# EAGLE design card_shield (EAGLE 9.2.0)
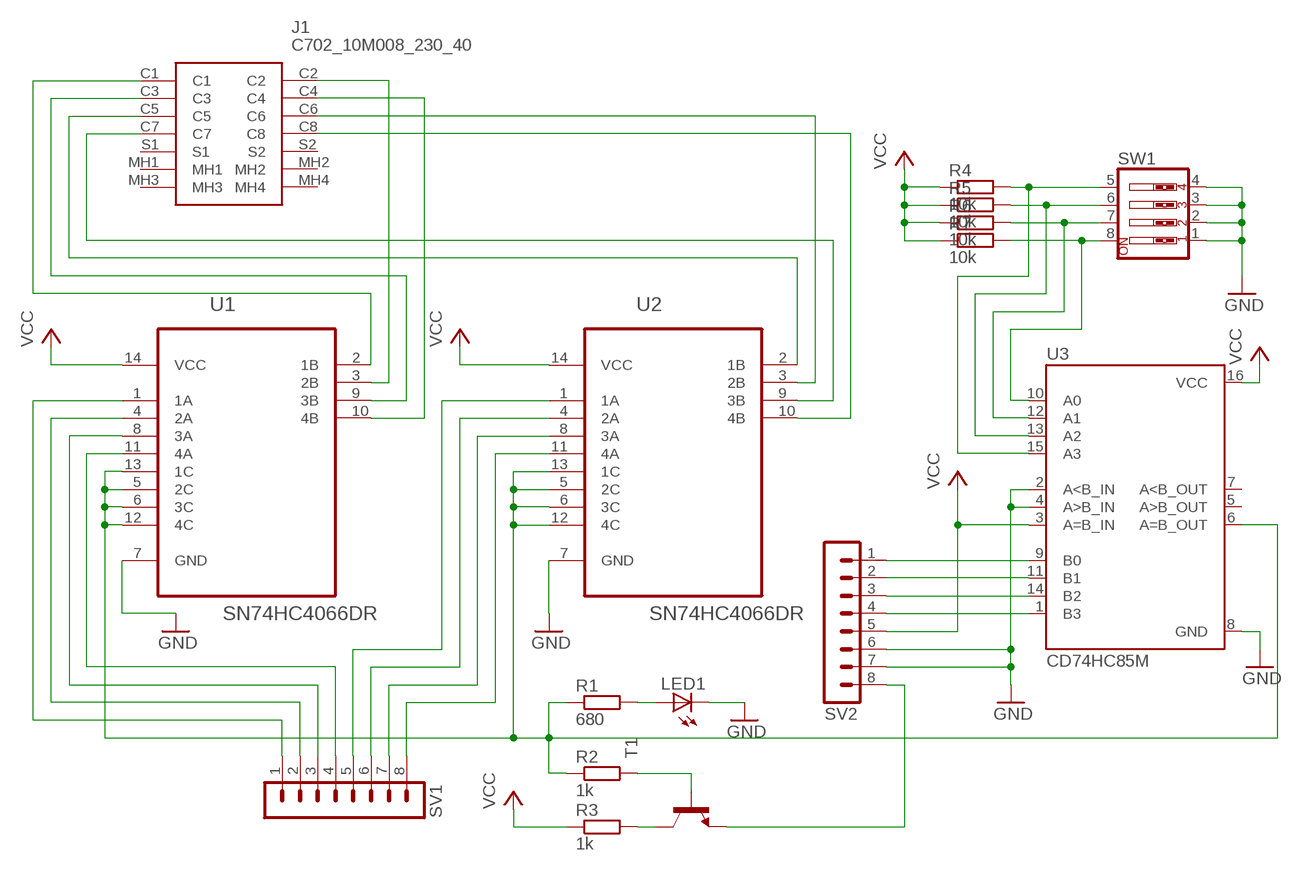
[diagram p0: schematic, sheet 1]

## Parts
J1  C702_10M008_230_40  [C70210M00823040]
LED1  LEDSML1206  [SML1206]
R1  680  R-EU_R0805  [R0805]
R2  1k  R-EU_R0805  [R0805]
R3  1k  R-EU_R0805  [R0805]
R4  10k  R-EU_R0805  [R0805]
R5  10k  R-EU_R0805  [R0805]
R6  10k  R-EU_R0805  [R0805]
R7  10k  R-EU_R0805  [R0805]
SV1  MA08-1  [MA08-1]
SV2  MA08-1  [MA08-1]
SW1  SW_DIP-4  [EDG-04]
T1  BC817-16-NPN-SOT23-BEC  [SOT23-BEC]
U1  SN74HC4066DR  [SOIC127P600X175-14N]
U2  SN74HC4066DR  [SOIC127P600X175-14N]
U3  CD74HC85M  [SOIC12P600X175-16N]

## Nets
GND: LED1.C SV2.6 SV2.7 SW1.1 SW1.2 SW1.3 SW1.4 U1.7(GND) U2.7(GND) U3.2(A<B_IN) U3.4(A>B_IN) U3.8(GND)
N$1: J1.C1 U1.2(1B)
N$2: J1.C3 U1.9(3B)
N$3: J1.C2 U1.3(2B)
N$4: J1.C4 U1.10(4B)
N$5: J1.C5 U2.2(1B)
N$6: J1.C6 U2.3(2B)
N$7: J1.C7 U2.9(3B)
N$8: J1.C8 U2.10(4B)
N$9: SV1.1 U1.1(1A)
N$10: SV1.2 U1.4(2A)
N$11: SV1.3 U1.8(3A)
N$12: SV1.4 U1.11(4A)
N$13: SV1.5 U2.1(1A)
N$14: SV1.6 U2.4(2A)
N$15: SV1.7 U2.8(3A)
N$16: SV1.8 U2.11(4A)
N$17: R1.1 R2.1 U1.5(2C) U1.6(3C) U1.12(4C) U1.13(1C) U2.5(2C) U2.6(3C) U2.12(4C) U2.13(1C) U3.6(A=B_OUT)
N$18: LED1.A R1.2
N$19: SV2.1 U3.9(B0)
N$20: R2.2 T1.B
N$21: SV2.2 U3.11(B1)
N$23: SV2.3 U3.14(B2)
N$24: SV2.4 U3.1(B3)
N$25: R7.2 SW1.8 U3.10(A0)
N$26: R6.2 SW1.7 U3.12(A1)
N$27: R5.2 SW1.6 U3.13(A2)
N$28: R4.2 SW1.5 U3.15(A3)
N$29: R3.2 T1.C
N$30: SV2.8 T1.E
VCC: R3.1 R4.1 R5.1 R6.1 R7.1 SV2.5 U1.14(VCC) U2.14(VCC) U3.3(A=B_IN) U3.16(VCC)
Unconnected: J1.MH1 J1.MH2 J1.MH3 J1.MH4 J1.S1 J1.S2 U3.5(A>B_OUT) U3.7(A<B_OUT)

## Library data of the parts
J1 = SamacSys_Parts:C702_10M008_230_40: AMPHENOL SINE/TUCHEL - C702 10M008 230 40 - SMART CARD, C702, WIPING XXS Source: Datasheet <https://componentsearchengine.com/Datasheets/1/C702 10M008 230 40.pdf>; DESCRIPTION: AMPHENOL SINE/TUCHEL - C702 10M008 230 40 - SMART CARD, C702, WIPING XXS; HEIGHT: 6mm; MANUFACTURER_NAME: Amphenol; MANUFACTURER_PART_NUMBER: C702 10M008 230 40; MOUSER_PART_NUMBER: 523-C70210M00823040
LED1 = led:LED: LED OSRAM: - CHIPLED LG R971, LG N971, LY N971, LG Q971, LY Q971, LO R971, LY R971 LH N974, LH R974 LS Q976, LO Q976, LY Q976 LO Q996 - Hyper CHIPLED LW Q18S LB Q993, LB Q99A, LB R99A - SideLED LS A670, LO A670, LY A670, LG A670, LP A670 LB A673, LV A673, LT A673, LW A673 LH A674 LY A675 LS A676, LA A676, LO A676, LY A676, LW A676 LS A679, LY A679, LG A679 - Hyper Micro SIDELED® LS Y876, LA Y876, LO Y876, LY Y876 LT Y87S - SmartLED LW L88C, LW L88S LB L89C, LB L89S, LG L890 LS L89K, LO L89K, LY L89K LS L896, LA L896, LO L896, LY L896 - TOPLED LS T670, LO T670, LY T670, LG T670, LP T670 LSG T670, LSP T670, LSY T670, LOP T670, LYG T670 LG T671, LOG T671, LSG T671 LB T673, LV T673, LT T673, LW T673 LH T674 LS T676, LA T676, LO T676, LY T676, LB T676, LH T676, LSB T676, LW T676 LB T67C, LV T67C, LT T67C, LS T67K, LO T67K, LY T67K, LW E67C LS E67B, LA E67B, LO E67B, LY E67B, LB E67C, LV E67C, LT E67C LW T67C LS T679, LY T679, LG T679 LS T770, LO T770, LY T770, LG T770, LP T770 LB T773, LV T773, LT T773, LW T773 LH T774 LS E675, LA E675, LY E675, LS T675 LS T776, LA T776, LO T776, LY T776, LB T776 LHGB T686 LT T68C, LB T68C - Hyper Mini TOPLED® LB M676 - Mini TOPLED Santana® LG M470 LS M47K, LO M47K, LY M47K Source: http://www.osram.convergy.de LUXEON: - LUMILED® LXK2-PW12-R00, LXK2-PW12-S00, LXK2-PW14-U00, LXK2-PW14-V00 LXK2-PM12-R00, LXK2-PM12-S00, LXK2-PM14-U00 LXK2-PE12-Q00, LXK2-PE12-R00, LXK2-PE12-S00, LXK2-PE14-T00, LXK2-PE14-U00 LXK2-PB12-K00, LXK2-PB12-L00, LXK2-PB12-M00, LXK2-PB14-N00, LXK2-PB14-P00, LXK2-PB14-Q00 LXK2-PR12-L00, LXK2-PR12-M00, LXK2-PR14-Q00, LXK2-PR14-R00 LXK2-PD12-Q00, LXK2-PD12-R00, LXK2-PD12-S00 LXK2-PH12-R00, LXK2-PH12-S00 LXK2-PL12-P00, LXK2-PL12-Q00, LXK2-PL12-R00 Source: www.luxeon.com KINGBRIGHT: KA-3528ASYC Source: www.kingbright.com
R1-R7 = rcl:R-EU_: RESISTOR, European symbol; SPICEPREFIX: R
SV1 SV2 = con-lstb:MA08-1: PIN HEADER; OC_FARNELL: unknown; OC_NEWARK: unknown
SW1 = special:SW_DIP-4: DIP SWITCH
T1 = transistor:*-NPN-: NPN Transistror BF959 corrected 2008.03.06
U1 U2 = SN74HC4066DR:SN74HC4066DR: QUADRUPLE BILATERAL ANALOG SWITCH; AVAILABILITY: Unavailable; DESCRIPTION: Logic - Signal Switches Quadruple Bilateral Analog Switches; MF: Texas Instruments; MP: SN74HC4066DR; PACKAGE: SOIC-14 Texas Instruments; PRICE: None
U3 = CD74HC85M:CD74HC85M: IC: digital; 4bit, comparator; SMD; SO16; Series: HC; AVAILABILITY: Unavailable; DESCRIPTION: IC: digital; 4bit, comparator; SMD; SO16; Series: HC; MF: Texas Instruments; MP: CD74HC85M; PACKAGE: SOIC-16 Texas Instruments; PRICE: None

## Board
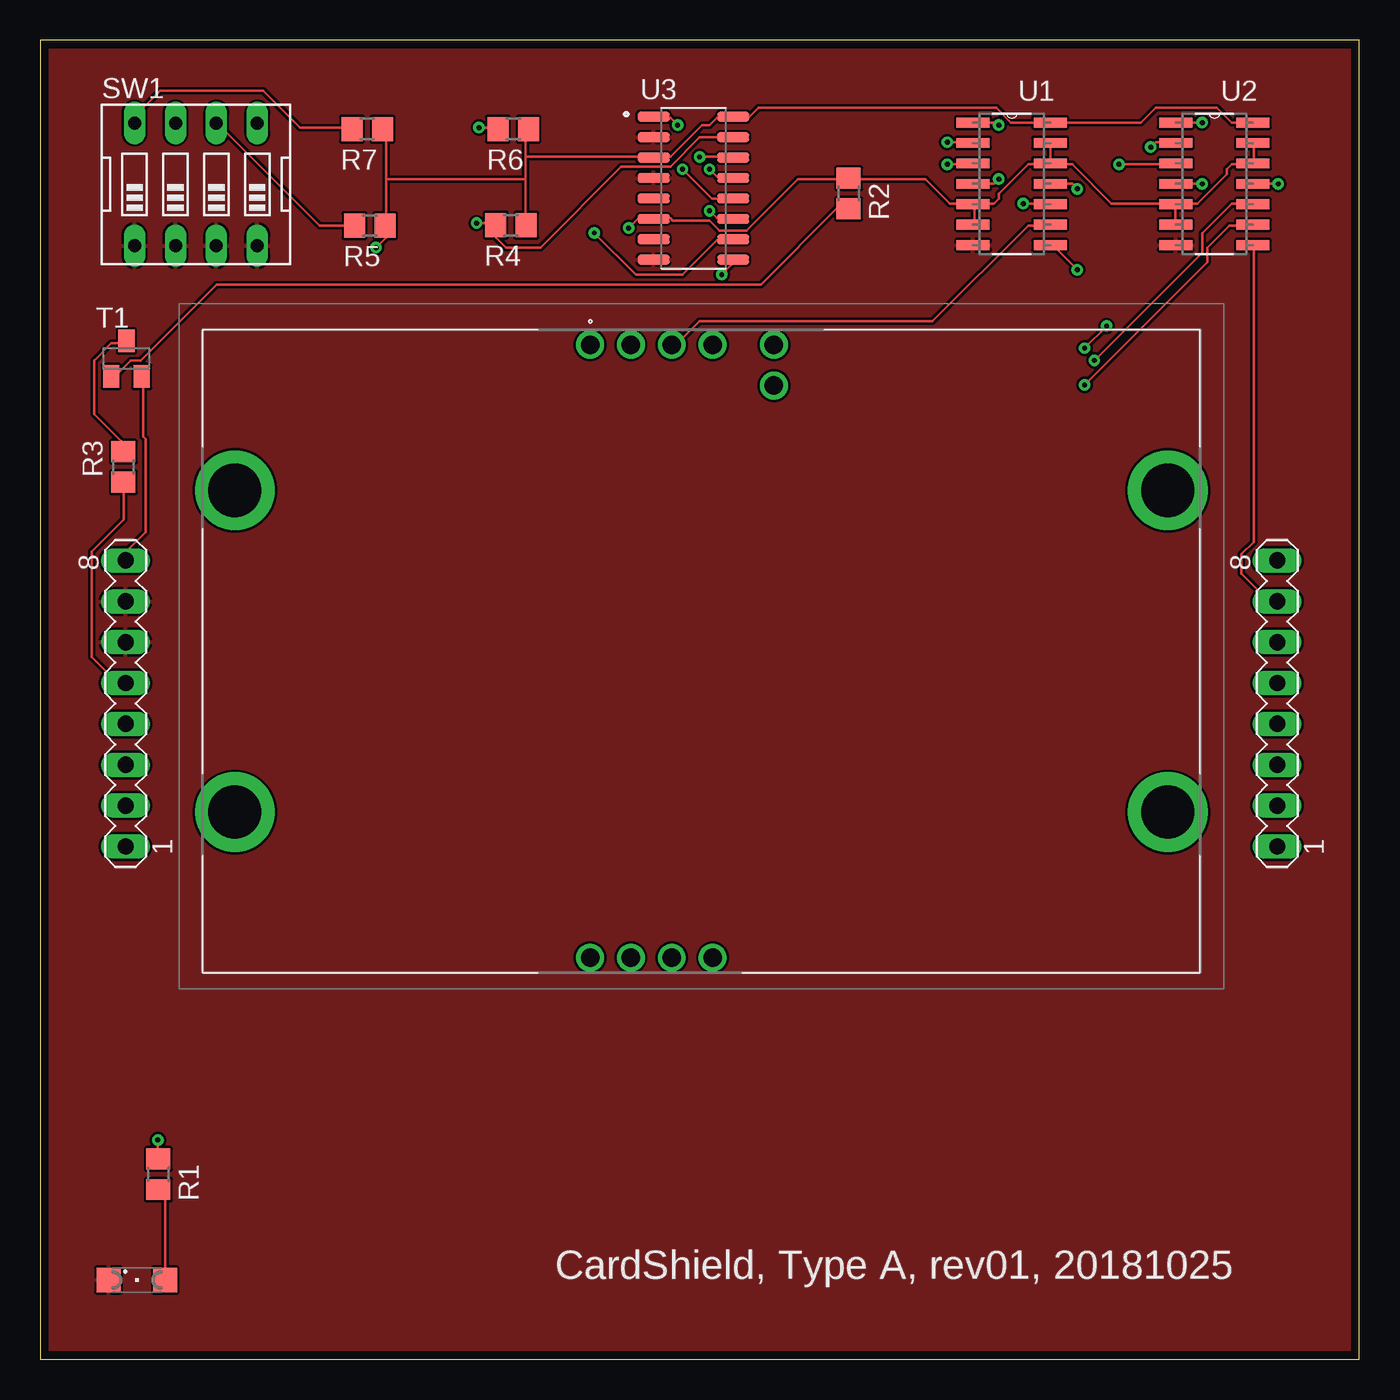
[diagram p1: board, top side]
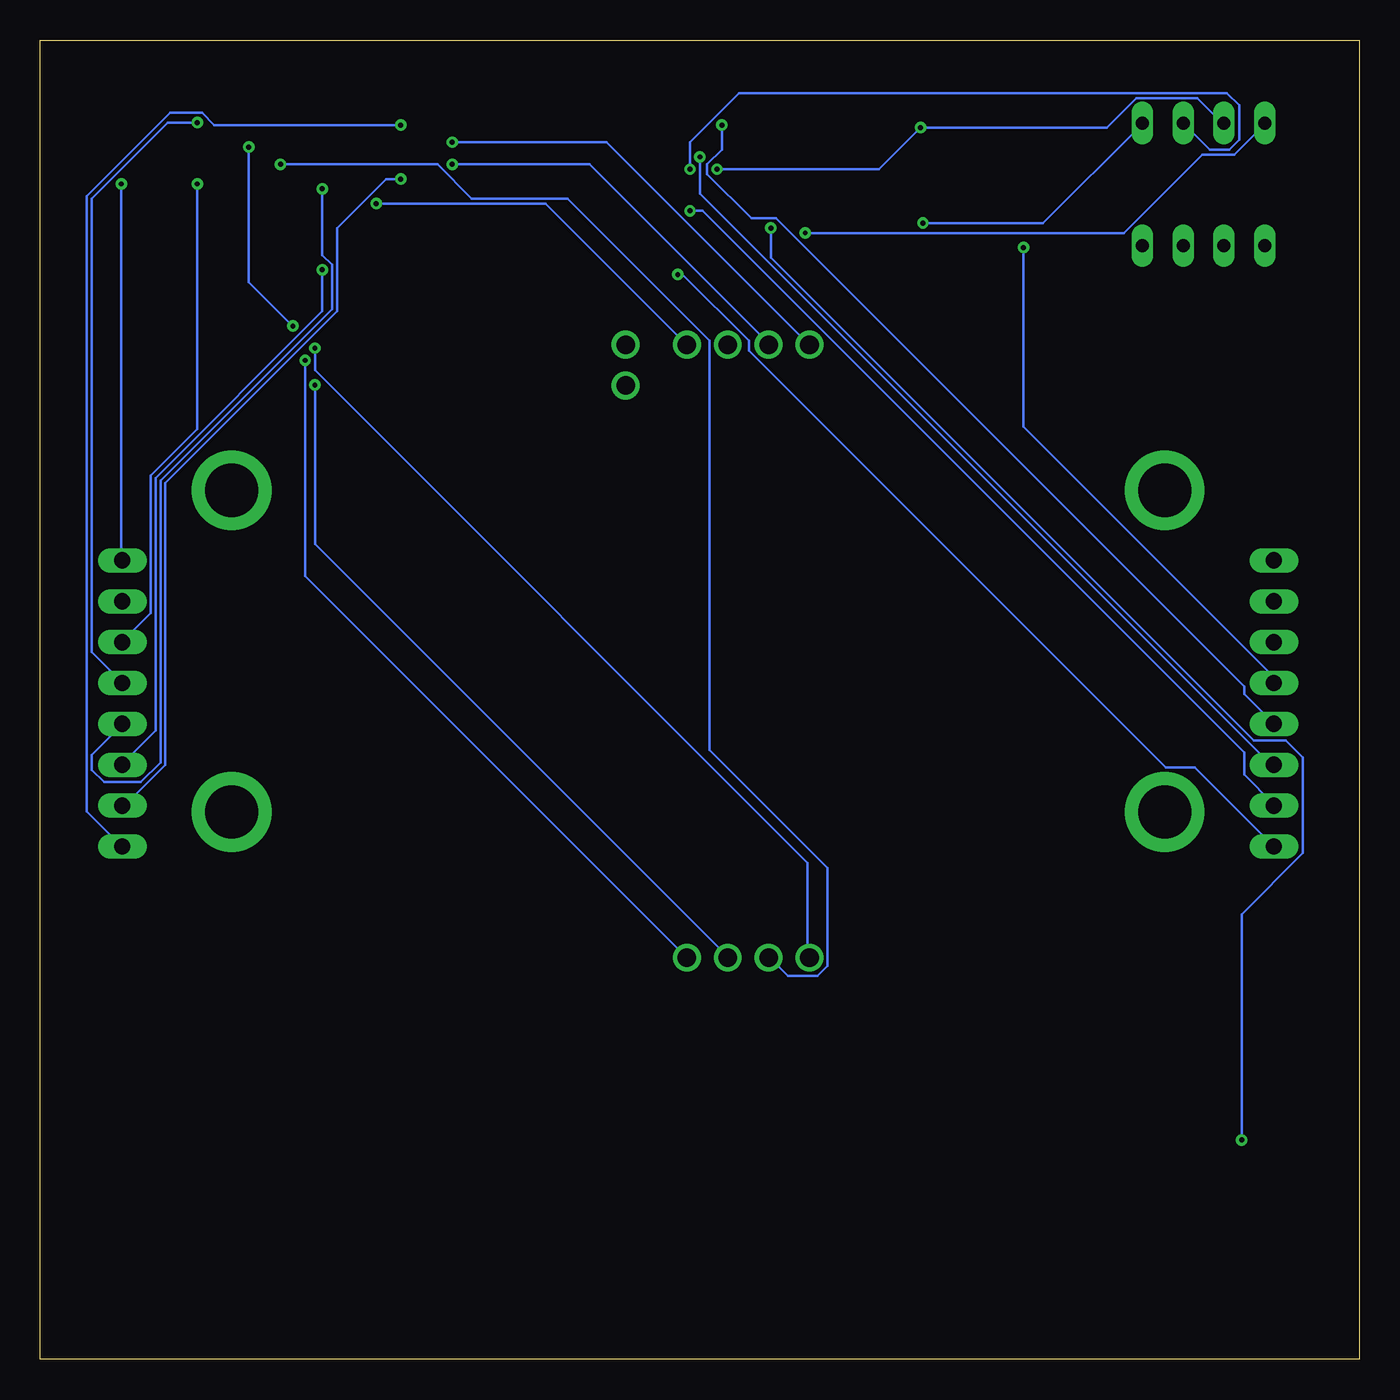
[diagram p2: board, bottom side, seen from below]

Size 82 x 82 mm. Coordinates in mm from the lower left corner, seen from the top.
Outline: 0,0 82,0 82,82 0,82 0,0
Copper layers (1*16): Top 0.035mm / dielectric 1.5mm / Bottom 0.035mm
Design rules "NYAKARUHAZ_StandardNYAK": minimum track width 6mil, minimum drill 12mil, track to track 6mil, track to pad 6mil, pad to pad 6mil, via to via 6mil, smd to smd 6mil, copper to edge 20mil, drill to drill 8mil, minimum pad ring 10mil, minimum via ring 8mil, stop-mask expansion 4mil, vias tented up to drill 0mil, thermal gap 6mil

### Footprints (pad centres in the part's own frame; a part is rotated, then mirrored left to right if it is on the bottom)
C70210M00823040 = drill 1.15 pad 1.725: C1 -6.92,19.05; C2 -4.38,19.05; C3 -1.84,19.05; C4 0.7,19.05; C5 -6.92,-19.05; C6 -4.38,-19.05; C7 -1.84,-19.05; C8 0.7,-19.05; S1 4.51,19.05; S2 4.51,16.51 | drill 3.3 pad 4.95: MH1 -29,10; MH2 -29,-10; MH3 29,10; MH4 29,-10
SML1206 = smd 1.5 x 1.5: A 1.75,0; C -1.75,0
R0805 = smd 1.3 x 1.5: 1 -0.95,0; 2 0.95,0
MA08-1 = drill 1.016 long: 1 -8.89,0; 2 -6.35,0; 3 -3.81,0; 4 -1.27,0; 5 1.27,0; 6 3.81,0; 7 6.35,0; 8 8.89,0
EDG-04 = drill 0.813 long: 1 -3.81,-3.81; 2 -1.27,-3.81; 3 1.27,-3.81; 4 3.81,-3.81; 5 3.81,3.81; 6 1.27,3.81; 7 -1.27,3.81; 8 -3.81,3.81
SOT23-BEC = smd 1 x 1.4: B -0.95,-1.1; C 0,1.1; E 0.95,-1.1
SOIC127P600X175-14N = smd 2.057 x 0.61: 1 -4.801,7.62; 2 -4.801,6.35; 3 -4.801,5.08; 4 -4.801,3.81; 5 -4.801,2.54; 6 -4.801,1.27; 7 -4.801,0; 8 0,0; 9 0,1.27; 10 0,2.54; 11 0,3.81; 12 0,5.08; 13 0,6.35; 14 0,7.62
SOIC12P600X175-16N = smd 1.97 x 0.6: 1 -2.475,4.445; 2 -2.475,3.175; 3 -2.475,1.905; 4 -2.475,0.635; 5 -2.475,-0.635; 6 -2.475,-1.905; 7 -2.475,-3.175; 8 -2.475,-4.445; 9 2.475,-4.445; 10 2.475,-3.175; 11 2.475,-1.905; 12 2.475,-0.635; 13 2.475,0.635; 14 2.475,1.905; 15 2.475,3.175; 16 2.475,4.445

### Placement (x,y rotation side)
J1  41.1,44.02 0 top
LED1  6.01,4.93 0 top
R1  7.34,11.5 270 top
R2  50.25,72.47 270 top
R3  5.17,55.47 90 top
R4  29.26,70.5 180 top
R5  20.49,70.47 180 top
R6  29.41,76.47 180 top
R7  20.33,76.47 180 top
SV1  76.9,40.77 90 top
SV2  5.31,40.77 90 top
SW1  9.68,73.04 0 top
T1  5.36,62.2 0 top
U1  62.79,69.26 0 top
U2  75.39,69.26 0 top
U3  40.61,72.8 0 top

### Tracks (layer width: path | path; a pad name or v marks a point on that pad's centre or on a via)
GND
  pour Top: -1,83 85,83 87,81 87,-18 -2,-18 -2,82
N$1  (via drill 0.3)
  Top 0.152: v56.39,75.66 57.91,75.66 U1.2
  Bottom 0.152: v56.39,75.66 46.79,75.66 34.29,63.16 J1.C1
N$2
  Top 0.152: U1.9 62.79,70.48 61.42,70.48 55.47,64.53 41,64.53 39.62,63.16 39.32,63.16 J1.C3
N$3  (via drill 0.3)
  Top 0.152: v56.39,74.29 57.91,74.29 U1.3
  Bottom 0.152: v56.39,74.29 47.85,74.29 36.73,63.16 J1.C2
N$4  (via drill 0.3)
  Top 0.152: v61.11,71.85 62.79,71.85 U1.10
  Bottom 0.152: v61.11,71.85 50.6,71.85 41.91,63.16 J1.C4
N$5  (via drill 0.3)
  Top 0.152: v69.04,75.35 69.34,75.66 70.56,75.66 U2.2 | v64.92,62.86 v66.29,64.23
  Bottom 0.152: v69.04,75.35 69.04,66.97 v66.29,64.23 | v64.92,62.86 64.92,61.49 34.29,30.85 34.29,24.97 J1.C5
N$6  (via drill 0.3)
  Top 0.152: v67.06,74.29 70.56,74.29 U2.3
  Bottom 0.152: v67.06,74.29 57.3,74.29 55.17,72.15 49.23,72.15 40.39,63.31 40.39,37.86 33.07,30.55 33.07,24.45 33.68,23.84 35.51,23.84 36.58,24.91 J1.C6
N$7  (via drill 0.3)
  Top 0.152: v64.92,60.57 72.54,68.19 72.54,69.11 73.91,70.48 75.29,70.48 U2.9
  Bottom 0.152: v64.92,60.57 64.92,50.67 39.32,25.06 J1.C7
N$8  (via drill 0.3)
  Top 0.152: v65.53,62.1 72.24,68.8 72.24,70.02 74.07,71.85 75.29,71.85 U2.10
  Bottom 0.152: v65.53,62.1 65.53,48.68 41.91,25.06 J1.C8
N$9  (via drill 0.3)
  Top 0.152: v59.59,76.73 59.44,76.88 58.06,76.88 U1.1
  Bottom 0.152: v59.59,76.73 71.17,76.73 71.93,77.49 73.91,77.49 79.1,72.31 79.1,34.05 76.96,31.92 SV1.1
N$10  (via drill 0.3)
  Top 0.152: v59.59,73.37 59.28,73.07 58.06,73.07 U1.4
  Bottom 0.152: v59.59,73.37 60.5,73.37 63.55,70.33 63.55,65.14 74.22,54.48 74.22,36.95 76.81,34.36 SV1.2
N$11  (via drill 0.3)
  Top 0.152: v64.47,67.73 62.94,69.26 U1.8
  Bottom 0.152: v64.47,67.73 64.47,65.14 74.83,54.78 74.83,39.08 76.81,37.1 SV1.3
N$12  (via drill 0.3)
  Top 0.152: v64.47,72.76 64.16,73.07 62.94,73.07 U1.11
  Bottom 0.152: v64.47,72.76 64.47,68.65 63.86,68.04 63.86,65.3 74.52,54.63 74.52,37.1 75.74,35.88 78.03,35.88 78.79,36.65 78.79,37.56 76.96,39.39 SV1.4
N$13  (via drill 0.3)
  Top 0.152: v72.24,76.88 70.71,76.88 U2.1
  Bottom 0.152: v72.24,76.88 74.07,76.88 78.79,72.15 78.79,43.96 76.96,42.13 SV1.5
N$14  (via drill 0.3)
  Top 0.152: v72.24,73.07 70.71,73.07 U2.4
  Bottom 0.152: v72.24,73.07 72.24,57.83 75.13,54.93 75.13,46.4 76.81,44.72 SV1.6
N$15
  Top 0.152: U2.8 75.44,69.26 75.44,50.82 74.68,50.06 74.68,48.84 76.35,47.16 76.81,47.16 SV1.7
N$16  (via drill 0.3)
  Top 0.152: v76.96,73.07 75.44,73.07 U2.11
  Bottom 0.152: v76.96,73.07 76.96,49.75 SV1.8
N$17  (via drill 0.3)
  Top 0.152: U2.6 70.56,70.63 70.56,71.7 U2.5 | U2.13 75.44,75.51 75.44,74.44 U2.12 75.29,74.29 74.07,74.29 73.76,73.98 73.76,73.68 71.93,71.85 70.71,71.85 U2.5 | U1.12 62.79,74.44 62.79,75.51 U1.13 | U1.5 57.91,71.85 56.54,71.85 55.02,73.37 50.29,73.37 R2.1 50.14,73.37 47.09,73.37 43.89,70.17 42.22,70.17 41.6,70.78 39.32,70.78 39.17,70.94 38.25,70.94 U3.6 38.1,70.94 37.19,70.94 v36.58,70.33 | U1.6 58.06,70.63 58.06,71.7 U1.5 | U1.12 62.79,74.29 61.42,74.29 59.59,72.46 59.59,72.15 59.28,71.85 58.06,71.85 U1.5 | U2.5 70.56,71.85 66.6,71.85 64.16,74.29 62.94,74.29 U1.12 | v7.32,13.63 7.32,12.57 R1.1
  Bottom 0.152: v7.32,13.63 7.32,27.65 3.5,31.46 3.5,37.41 4.57,38.47 6.55,38.47 36.58,68.5 v36.58,70.33
N$18
  Top 0.152: LED1.A 7.77,4.95 7.77,10.13 7.47,10.43 R1.2
N$19  (via drill 0.3)
  Top 0.152: v42.37,67.43 42.98,68.04 42.98,68.34 U3.9
  Bottom 0.152: v42.37,67.43 42.06,67.43 37.95,63.31 37.95,62.7 12.04,36.8 10.21,36.8 5.33,31.92 SV2.1
N$20
  Top 0.152: T1.B 4.42,61.18 4.72,61.18 5.64,62.1 6.25,62.1 10.97,66.82 44.81,66.82 49.53,71.54 50.14,71.54 R2.2
N$21  (via drill 0.3)
  Top 0.152: v41.6,71.39 42.06,70.94 42.98,70.94 U3.11
  Bottom 0.152: v41.6,71.39 40.84,71.39 7.16,37.71 7.16,36.34 5.33,34.51 SV2.2
N$23  (via drill 0.3)
  Top 0.152: v41,74.75 42.98,74.75 U3.14
  Bottom 0.152: v41,74.75 41,72.46 5.64,37.1 5.33,37.1 SV2.3
N$24  (via drill 0.3)
  Top 0.152: v39.62,76.73 39.17,77.18 38.25,77.18 U3.1
  Bottom 0.152: v39.62,76.73 39.62,75.2 40.54,74.29 40.54,73.68 37.8,70.94 36.27,70.94 7.16,41.83 7.16,41.37 5.33,39.54 SV2.4
N$25  (via drill 0.3)
  Top 0.152: R7.2 19.36,76.57 16.15,76.57 13.87,78.86 7.47,78.86 5.94,77.34 5.94,76.88 SW1.8 | v34.44,70.02 37.03,67.43 39.93,67.43 42.06,69.56 42.98,69.56 U3.10
  Bottom 0.152: v34.44,70.02 14.63,70.02 9.75,74.9 7.77,74.9 5.94,76.73 SW1.8
N$26  (via drill 0.3)
  Top 0.152: v27.28,76.57 28.35,76.57 R6.2 | v39.93,73.98 41.76,72.15 42.98,72.15 U3.12
  Bottom 0.152: SW1.7 8.53,76.88 10.06,78.4 13.87,78.4 15.7,76.57 v27.28,76.57 29.87,73.98 v39.93,73.98
N$27  (via drill 0.3)
  Top 0.152: R5.2 19.51,70.48 17.37,70.48 10.97,76.88 SW1.6 | v41.6,73.98 42.06,73.53 42.98,73.53 U3.13
  Bottom 0.152: v41.6,73.98 41.6,75.66 38.56,78.71 8.23,78.71 7.47,77.94 7.47,75.81 8.08,75.2 9.3,75.2 10.82,76.73 SW1.6
N$28  (via drill 0.3)
  Top 0.152: v27.13,70.63 28.19,70.63 R4.2 28.35,70.48 28.35,69.72 28.96,69.11 31.09,69.11 36.12,74.14 39.17,74.14 41,75.96 42.98,75.96 U3.15
  Bottom 0.152: v27.13,70.63 19.66,70.63 13.56,76.73 SW1.5
N$29
  Top 0.152: T1.C 5.33,63.16 4.42,63.16 3.35,62.1 3.35,58.74 5.03,57.07 5.03,56.46 R3.2
N$30
  Top 0.152: T1.E 6.4,61.03 6.4,57.37 6.55,57.22 6.55,51.43 5.33,50.21 5.33,49.75 SV2.8
VCC  (via drill 0.3)
  Top 0.152: R3.1 5.18,54.48 5.18,52.19 3.2,50.21 3.2,43.66 4.72,42.13 5.18,42.13 SV2.5 | U2.14 75.29,76.88 74.07,76.88 73.15,77.79 69.34,77.79 68.43,76.88 62.94,76.88 U1.14 60.35,76.88 59.44,77.79 44.65,77.79 44.04,77.18 43.13,77.18 U3.16 42.98,77.18 42.06,77.18 41.6,76.73 41.15,76.73 39.17,74.75 38.25,74.75 U3.3 38.1,74.75 30.18,74.75 | 21.49,73.37 21.49,76.27 21.34,76.42 R7.1 | 21.49,73.37 21.49,70.48 R5.1 21.49,70.33 21.49,69.72 v20.88,69.11 | 30.18,74.75 30.18,76.27 30.33,76.42 R6.1 | 30.18,74.75 30.18,73.37 | 30.18,73.37 30.18,70.63 R4.1 | 30.18,73.37 21.49,73.37
  Bottom 0.152: v20.88,69.11 20.88,57.98 5.33,42.44 5.33,42.13 SV2.5

### Text on the board
tNames: CardShield, Type A, rev01, 20181025